# EasyEDA schematic Smart Charger connection plate.json
TITLE: Sheet_1; REV: 1.0; Date: 2023-08-08; Sheet: 1/1; Company: Your Company
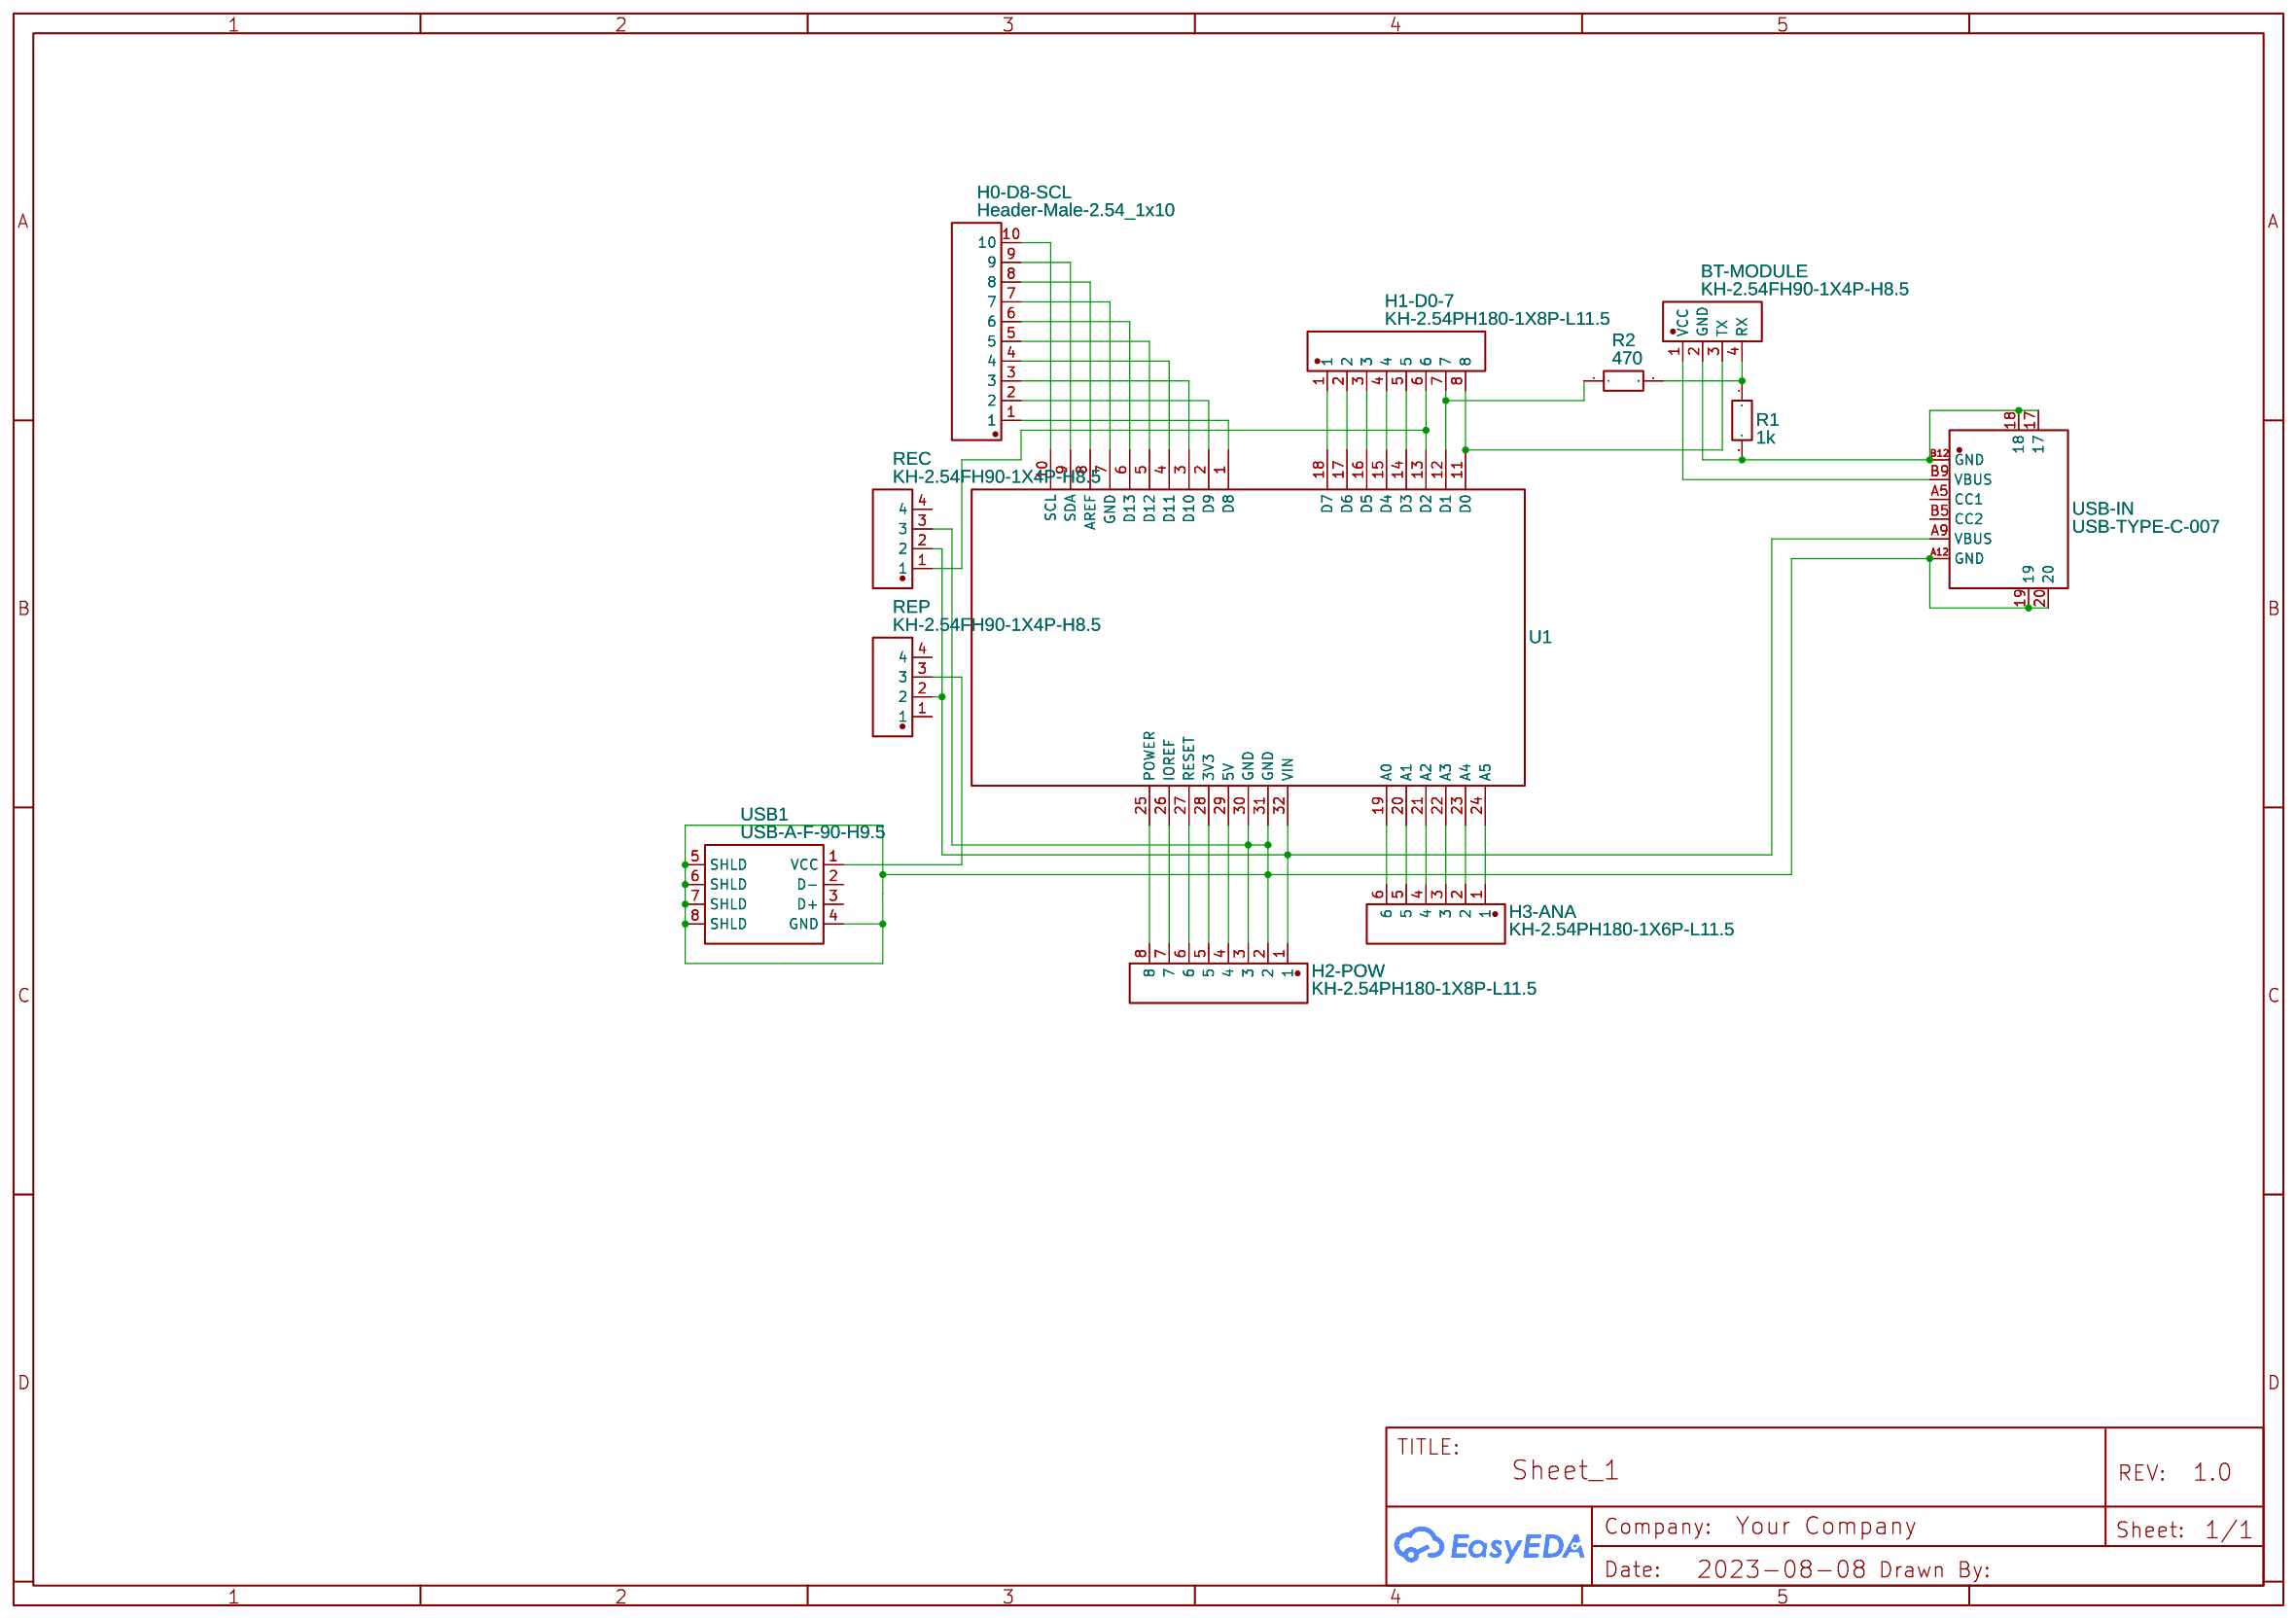
[diagram p0: schematic sheet]

## Parts
BT-MODULE  KH-2.54FH90-1X4P-H8.5  [HDR-TH_4P-P2.54-H-F-W10.2]
H0-D8-SCL  Header-Male-2.54_1x10  [HDR-TH_10P-P2.54-V-M-1]
H1-D0-7  KH-2.54PH180-1X8P-L11.5  [HDR-TH_8P-P2.54-V-M]
H2-POW  KH-2.54PH180-1X8P-L11.5  [HDR-TH_8P-P2.54-V-M]
H3-ANA  KH-2.54PH180-1X6P-L11.5  [HDR-TH_6P-P2.54-V-M-1]
R1  1k  [R0603]
R2  470  [R0603]
REC  KH-2.54FH90-1X4P-H8.5  [HDR-TH_4P-P2.54-H-F-W10.2]
REP  KH-2.54FH90-1X4P-H8.5  [HDR-TH_4P-P2.54-H-F-W10.2]
U1  NO  [UNO_R3]
USB1  USB-A-F-90-H9.5  [USB-A-TH_C168725]
USB-IN  USB-TYPE-C-007  [TYPE-C-SMD_USB-TYPE-C-007]

## Library data of the parts
BT-MODULE REC REP = KH-2.54FH90-1X4P-H8.5: Contributor: LCSC; Supplier: LCSC; Supplier Part: C2932680; Manufacturer: kinghelm(金航标); JLCPCB Part Class: Extended Part; link: https://lcsc.com/eda_search?q=C2932680&%26type=1&ref=editor
H0-D8-SCL = Header-Male-2.54_1x10: Supplier: LCSC; Manufacturer Part: 2.54-1*10P针; Supplier Part: C57369; JLCPCB Part Class: Extended Part; Manufacturer: BOOMELE(博穆精密); link: https://lcsc.com/eda_search?q=C57369&%26type=1&ref=editor
H1-D0-7 H2-POW = KH-2.54PH180-1X8P-L11.5: Contributor: LCSC; Supplier: LCSC; Supplier Part: C2905487; Manufacturer: kinghelm(金航标); JLCPCB Part Class: Extended Part; link: https://lcsc.com/eda_search?q=C2905487&%26type=1&ref=editor
H3-ANA = KH-2.54PH180-1X6P-L11.5: Contributor: LCSC; Supplier: LCSC; Supplier Part: C2905486; Manufacturer: kinghelm(金航标); JLCPCB Part Class: Extended Part; link: https://lcsc.com/eda_search?q=C2905486&%26type=1&ref=editor
R1 R2 = R_0603_EU: Contributor: LCEDA_Lib
U1 = UNO_R3: sourceId: 1T5FDZYC8
USB1 = USB-A-F-90-H9.5: Contributor: LCSC; Supplier: LCSC; Supplier Part: C168725; Manufacturer: LCSC; JLCPCB Part Class: Extended Part; link: https://lcsc.com/eda_search?q=C168725&%26type=1&ref=editor
USB-IN = USB-TYPE-C-007: Contributor: lcsc; Supplier: LCSC; Supplier Part: C2927027; Manufacturer: DEALON(德艺隆); JLCPCB Part Class: Extended Part; link: https://lcsc.com/eda_search?q=C2927027&%26type=1&ref=editor

## Nets
Net-(BT-MODULE-1): BT-MODULE.1(VCC) USB-IN.B9(VBUS)
Net-(BT-MODULE-2): BT-MODULE.2(GND) R1.2 USB-IN.17 USB-IN.18 USB-IN.B12(GND)
Net-(BT-MODULE-3): BT-MODULE.3(TX) H1-D0-7.8 U1.11(D0)
Net-(BT-MODULE-4): BT-MODULE.4(RX) R1.1 R2.2
Net-(H0-D8-SCL-1): H0-D8-SCL.1 U1.1(D8)
Net-(H0-D8-SCL-2): H0-D8-SCL.2 U1.2(D9)
Net-(H0-D8-SCL-3): H0-D8-SCL.3 U1.3(D10)
Net-(H0-D8-SCL-4): H0-D8-SCL.4 U1.4(D11)
Net-(H0-D8-SCL-5): H0-D8-SCL.5 U1.5(D12)
Net-(H0-D8-SCL-6): H0-D8-SCL.6 U1.6(D13)
Net-(H0-D8-SCL-7): H0-D8-SCL.7 U1.7(GND)
Net-(H0-D8-SCL-8): H0-D8-SCL.8 U1.8(AREF)
Net-(H0-D8-SCL-9): H0-D8-SCL.9 U1.9(SDA)
Net-(H0-D8-SCL-10): H0-D8-SCL.10 U1.10(SCL)
Net-(H1-D0-7-1): H1-D0-7.1 U1.18(D7)
Net-(H1-D0-7-2): H1-D0-7.2 U1.17(D6)
Net-(H1-D0-7-3): H1-D0-7.3 U1.16(D5)
Net-(H1-D0-7-4): H1-D0-7.4 U1.15(D4)
Net-(H1-D0-7-5): H1-D0-7.5 U1.14(D3)
Net-(H1-D0-7-6): H1-D0-7.6 REC.1 U1.13(D2)
Net-(H1-D0-7-7): H1-D0-7.7 R2.1 U1.12(D1)
Net-(H2-POW-1): H2-POW.1 REC.2 REP.2 U1.32(VIN) USB-IN.A9(VBUS)
Net-(H2-POW-2): H2-POW.2 H2-POW.3 REC.3 U1.30(GND) U1.31(GND) USB1.4(GND) USB1.5(SHLD) USB1.6(SHLD) USB1.7(SHLD) USB1.8(SHLD) USB-IN.19 USB-IN.20 USB-IN.A12(GND)
Net-(H2-POW-4): H2-POW.4 U1.29(5V)
Net-(H2-POW-5): H2-POW.5 U1.28(3V3)
Net-(H2-POW-6): H2-POW.6 U1.27(RESET)
Net-(H2-POW-7): H2-POW.7 U1.26(IOREF)
Net-(H2-POW-8): H2-POW.8 U1.25(POWER)
Net-(H3-ANA-1): H3-ANA.1 U1.24(A5)
Net-(H3-ANA-2): H3-ANA.2 U1.23(A4)
Net-(H3-ANA-3): H3-ANA.3 U1.22(A3)
Net-(H3-ANA-4): H3-ANA.4 U1.21(A2)
Net-(H3-ANA-5): H3-ANA.5 U1.20(A1)
Net-(H3-ANA-6): H3-ANA.6 U1.19(A0)
Net-(REP-3): REP.3 USB1.1(VCC)

Not connected (* = marked no-connect by the designer): REC 4; REP 1 4; USB1 2(D-) 3(D+); USB-IN A5(CC1) B5(CC2)
